# EasyEDA Pro project ProPrj_ch32_dev.epro

# Schematic Schematic1
Board Name: Board1; Create Date: 2026-04-19; Page Name: P1; Project Name: ch32_dev; Schematic Name: Schematic1; Update Date: 2026-04-19; Company: EasyEDA.com; Page Size: A4; Version: V1.0
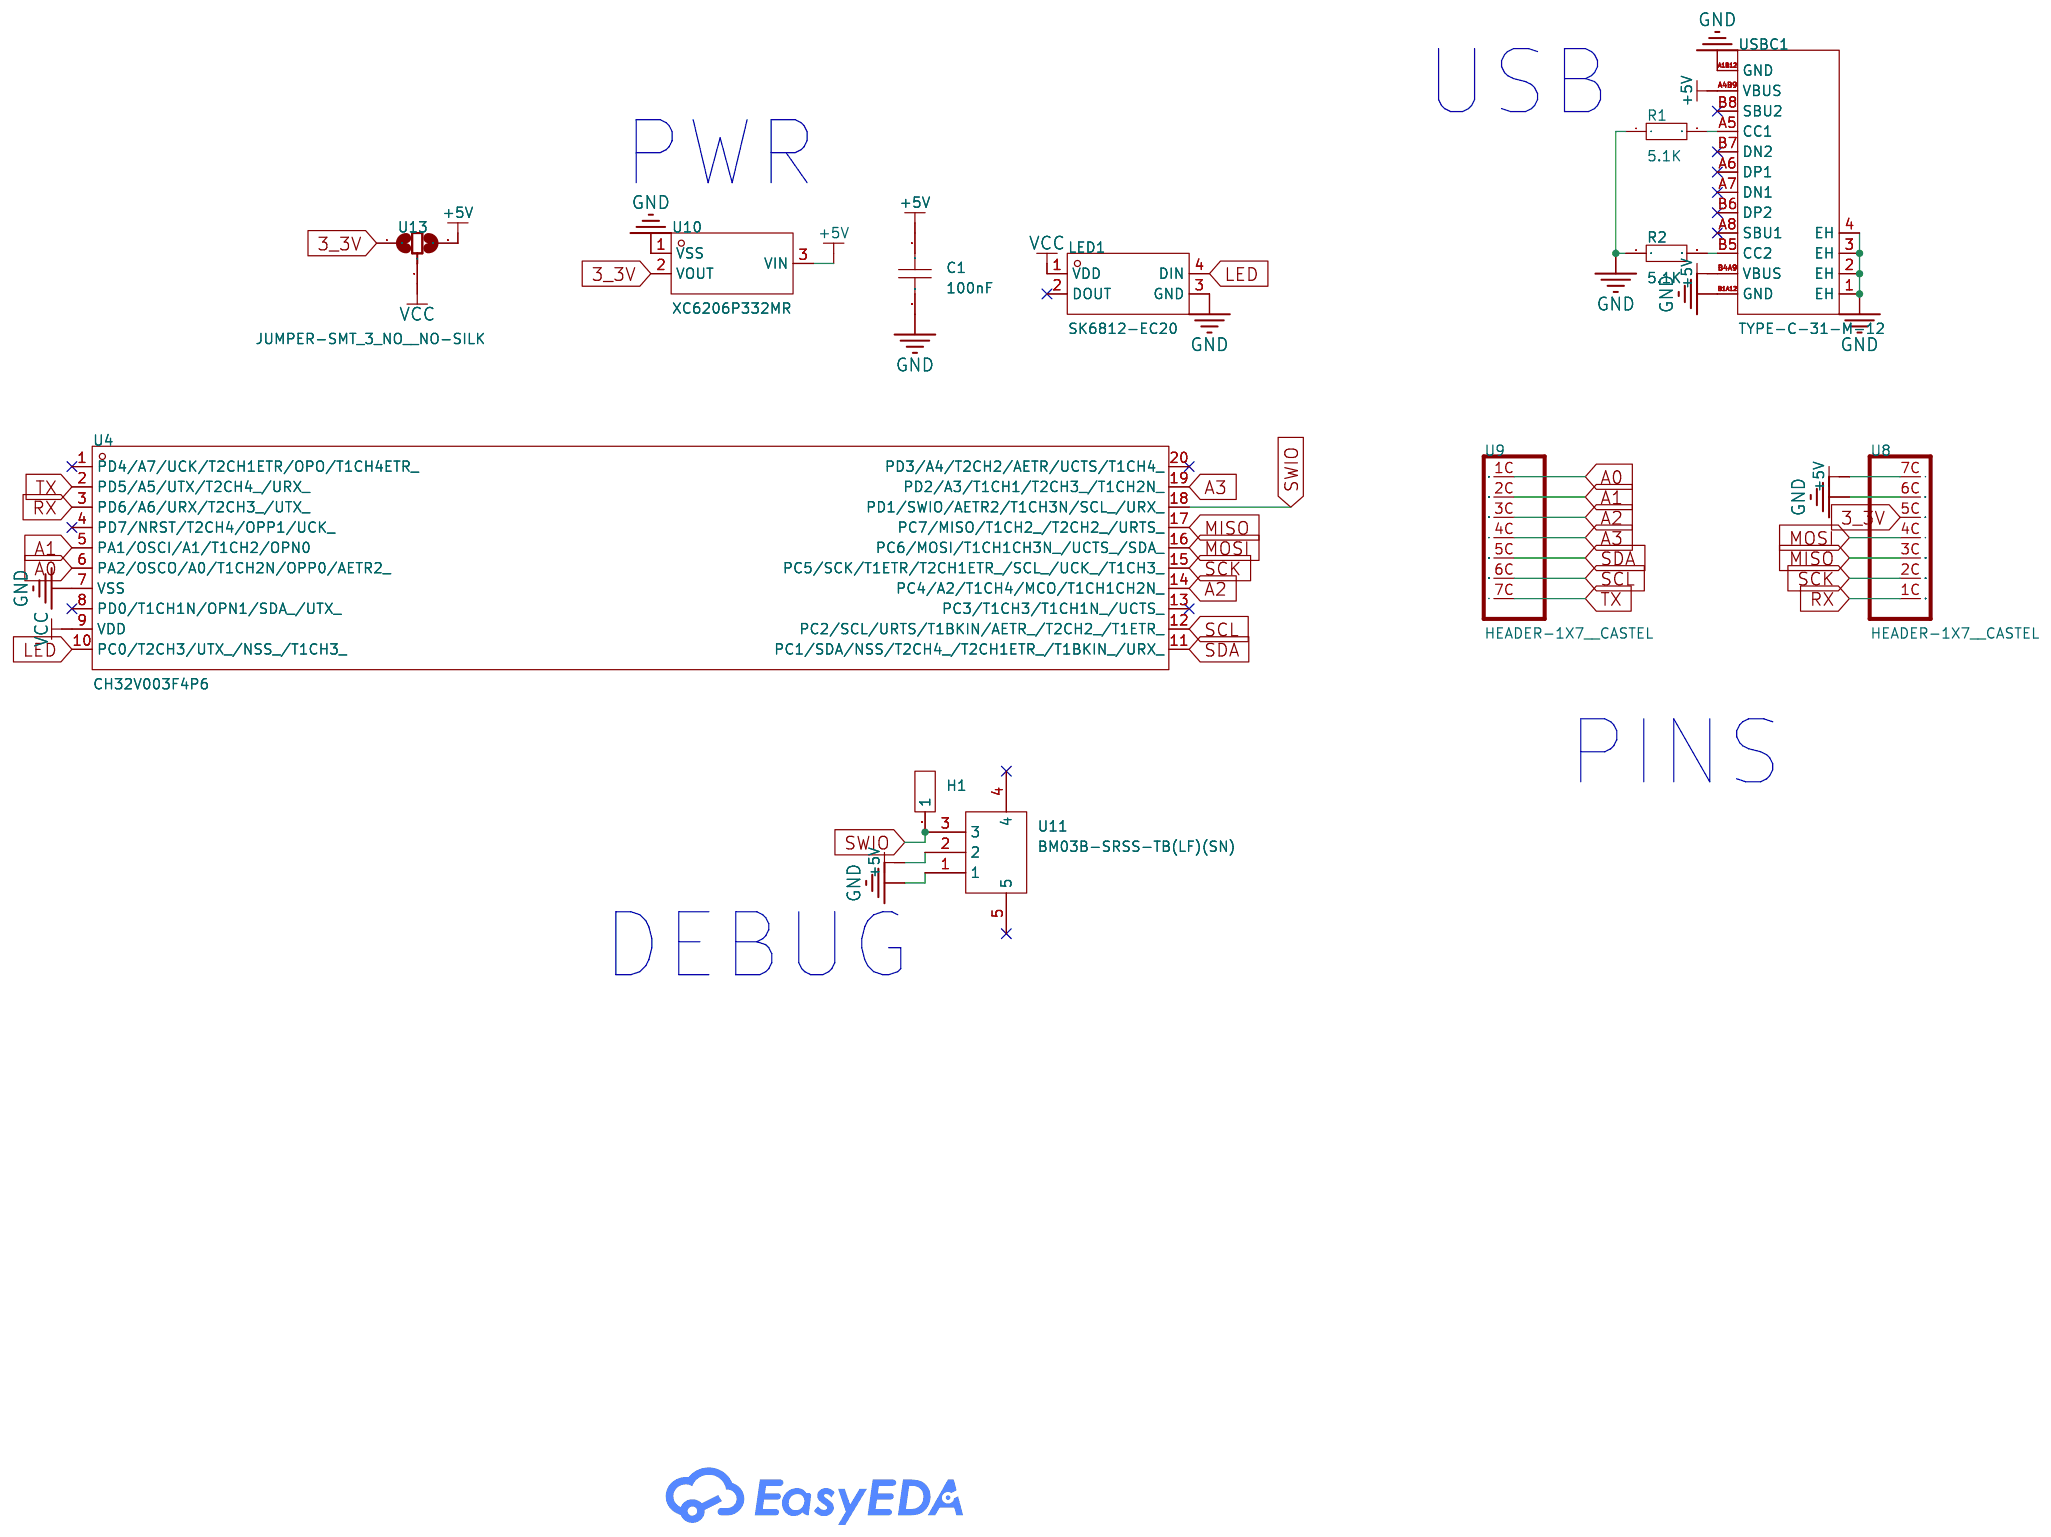
[diagram p0: schematic sheet]

## Parts
C1  100nF  [C0603]
H1  -  [HDR-TH_1P-V-M_XKB_X4611WV-01I-C28D40]
LED1  SK6812-EC20  [LED-SMD_4P-L2.0-W2.0-BR]
R1  5.1K  [R0603]
R2  5.1K  [R0603]
U4  CH32V003F4P6  [TSSOP-20_L6.5-W4.4-P0.65-LS6.4-BL]
U8  HEADER-1X7__CASTEL  [1X07_CASTEL]
U9  HEADER-1X7__CASTEL  [1X07_CASTEL]
U10  XC6206P332MR  [SOT-23-3_L3.0-W1.7-P0.95-LS2.9-BR]
U11  BM03B-SRSS-TB(LF)(SN)  [CONN-SMD-3P-P1.00_BM03B-SRSS-TB-LF-SN]
U13  JUMPER-SMT_3_NO__NO-SILK  [SMT-JUMPER_3_NO_NO-SILK]
USBC1  TYPE-C-31-M-12  [USB-C_SMD-TYPE-C-31-M-12_1]

## Library data of the parts
C1 = CAP_0603: Supplier Footprint: 0603
H1 = HDR-M_2.54_1x1P: Supplier Footprint: Through
LED1 = SK6812-EC20: Wavelength:620nm~630nm；520nm~535nm；460nm~475nm Operating Temperature:-40℃~+80℃; LCSC Part Name: RGB三色; Supplier Part: C2909058; Manufacturer: 欧思科光电; Supplier Footprint: SMD,2x2mm; JLCPCB Part Class: Extended Part; Datasheet: https://item.szlcsc.com/datasheet/SK6812-EC20/3185286.html; Supplier: LCSC; Wavelength: 620nm~630nm；520nm~535nm；460nm~475nm; Operating Temperature: -40℃~+80℃
R1 R2 = Res_0603: Supplier Footprint: 0603
U4 = CH32V003F4P6: LCSC Part Name: QingKe V2微处理器; Supplier Part: C5187096; Manufacturer: WCH(南京沁恒); Supplier Footprint: TSSOP-20-175mil; JLCPCB Part Class: Extended Part; Datasheet: https://item.szlcsc.com/datasheet/CH32V003F4P6/5858783.html; Supplier: LCSC
U8 U9 = HEADER-1X7__CASTEL
U10 = XC6206P332MR_C347376: Output Type:Fixed Voltage - Supply:8V Output Voltage:3.3V Output Voltage:3.3V Output Current:250mA Power Supply Rejection Ratio (PSRR):40dB@(1kHz) Voltage Dropout:240mV@(50mA) standby current:7uA Noise:- Features:Over Current Protection；Short Circuit Prot; LCSC Part Name: 高纹波抑制率、低功耗、低压差 CMOS 降压型电压稳压器; Supplier Part: C347376; Manufacturer: UMW(友台半导体); Supplier Footprint: SOT-23; JLCPCB Part Class: Extended Part; Datasheet: https://item.szlcsc.com/datasheet/XC6206P332MR/324036.html; Supplier: LCSC; Output Type: Fixed; Voltage - Supply: 8V; Output Voltage: 3.3V; Output Current: 250mA; Power Supply Rejection Ratio (PSRR): 40dB@(1kHz); Voltage Dropout: 240mV@(50mA); standby current: 7uA; Features: Over Current Protection；Short Circuit Protection; Operating Temperature: -25℃~+80℃@(Ta); Output Configuration: Positive; Number of Outputs: 1
U11 = BM03B-SRSS-TB(LF)(SN): Pins Structure:1x3P Pitch:1mm Mounting Type:Surface Mount,Vertical Reference Series:SH Number of Pins:3P Number of Rows:1 Number of PINs Per Row:3 Row Spacing:- Current Rating:1A Contact Material:Copper Alloy Contact Plating:Tin Operating Temperature:-25℃; LCSC Part Name: 1x3P 间距:1mm 立贴 系列:SH; Supplier Part: C160389; Manufacturer: JST; Supplier Footprint: SMD,P=1mm; JLCPCB Part Class: Extended Part; Datasheet: https://item.szlcsc.com/datasheet/BM03B-SRSS-TB(LF)(SN)/171769.html; Supplier: LCSC; Pins Structure: 1x3P; Pitch: 1mm; Mounting Type: Surface Mount,Vertical; Reference Series: SH; Number of Pins: 3P; Number of Rows: 1; Number of PINs Per Row: 3; Current Rating: 1A; Contact Material: Copper Alloy; Contact Plating: Tin; Operating Temperature: -25℃~+85℃; Voltage Rating: 50V; Plastic Material: PA; Flame Retardant Rating: UL94V-0; Supplementary Features: Auxiliary Solder Pin; Color: White; Z-Height of the Board: 4.25mm; X-Length of Bottom Edge on Board (Spacing Line): 5mm; Y-Width of Bottom Edge on Board: 3.6mm
U13 = JUMPER-SMT_3_NO__NO-SILK
USBC1 = TYPE-C-31-M-12: Connector Type:Type-C Protocol Standard:- Gender:Female Mounting Type:Surface Mount, Right Angle Number of Contacts:16P Number of Ports:1 Current Rating-Power:5A Voltage Rating:20V Connect-Disconnect Life:10,000 cycles Length:7.35mm Operating Temperature:; LCSC Part Name: Type-C 母 卧贴; Supplier Part: C165948; Manufacturer: 韩国韩荣; Supplier Footprint: SMD; JLCPCB Part Class: Extended Part; Datasheet: https://item.szlcsc.com/datasheet/TYPE-C-31-M-12/177331.html; Supplier: LCSC; Connector Type: Type-C; Gender: Female; Mounting Type: Surface Mount, Right Angle; Number of Contacts: 16P; Number of Ports: 1; Current Rating-Power: 5A; Voltage Rating: 20V; Connect-Disconnect Life: 10,000 cycles; Length: 7.35mm; Operating Temperature: -30℃~+80℃

## Nets
+5V: C1.1 U8.7C(7) U10.3(VIN) U11.2 U13.3 USBC1.A4B9(VBUS) USBC1.B4A9(VBUS)
GND: C1.2 LED1.3(GND) R1.1 R2.1 U4.7(VSS) U8.6C(6) U10.1(VSS) U11.1 USBC1.1(EH) USBC1.2(EH) USBC1.3(EH) USBC1.4(EH) USBC1.A1B12(GND) USBC1.B1A12(GND)
VCC: LED1.1(VDD) U4.9(VDD) U13.2
3_3V: U8.5C(5) U10.2(VOUT) U13.1
A0: U4.6(PA2/OSCO/A0/T1CH2N/OPP0/AETR2_) U9.1C
A1: U4.5(PA1/OSCI/A1/T1CH2/OPN0) U9.2C
A2: U4.14(PC4/A2/T1CH4/MCO/T1CH1CH2N_) U9.3C
A3: U4.19(PD2/A3/T1CH1/T2CH3_/T1CH2N_) U9.4C(4)
LED: LED1.4(DIN) U4.10(PC0/T2CH3/UTX_/NSS_/T1CH3_)
MISO: U4.17(PC7/MISO/T1CH2_/T2CH2_/URTS_) U8.3C
MOSI: U4.16(PC6/MOSI/T1CH1CH3N_/UCTS_/SDA_) U8.4C(4)
RX: U4.3(PD6/A6/URX/T2CH3_/UTX_) U8.1C
SCK: U4.15(PC5/SCK/T1ETR/T2CH1ETR_/SCL_/UCK_/T1CH3_) U8.2C
SCL: U4.12(PC2/SCL/URTS/T1BKIN/AETR_/T2CH2_/T1ETR_) U9.6C(6)
SDA: U4.11(PC1/SDA/NSS/T2CH4_/T2CH1ETR_/T1BKIN_/URX_) U9.5C(5)
SWIO: H1.1 U4.18(PD1/SWIO/AETR2/T1CH3N/SCL_/URX_) U11.3
TX: U4.2(PD5/A5/UTX/T2CH4_/URX_) U9.7C(7)
$1N1231: R2.2 USBC1.B5(CC2)
$1N1237: R1.2 USBC1.A5(CC1)

Not connected (* = marked no-connect by the designer): LED1 2(DOUT)*; U4 1(PD4/A7/UCK/T2CH1ETR/OPO/T1CH4ETR_)* 4(PD7/NRST/T2CH4/OPP1/UCK_)* 8(PD0/T1CH1N/OPN1/SDA_/UTX_)* 13(PC3/T1CH3/T1CH1N_/UCTS_)* 20(PD3/A4/T2CH2/AETR/UCTS/T1CH4_)*; U11 4* 5*; USBC1 A6(DP1)* A7(DN1)* A8(SBU1)* B6(DP2)* B7(DN2)* B8(SBU2)*

## Notes on the sheet
- USB
- PWR
- PINS
- DEBUG

# Schematic Schematic1_1
Board Name: Board1_manual_route; Create Date: 2026-04-25; Page Name: P1; Project Name: ch32_dev; Schematic Name: Schematic1_1; Update Date: 2026-04-25; Company: EasyEDA.com; Page Size: A4; Version: V1.0
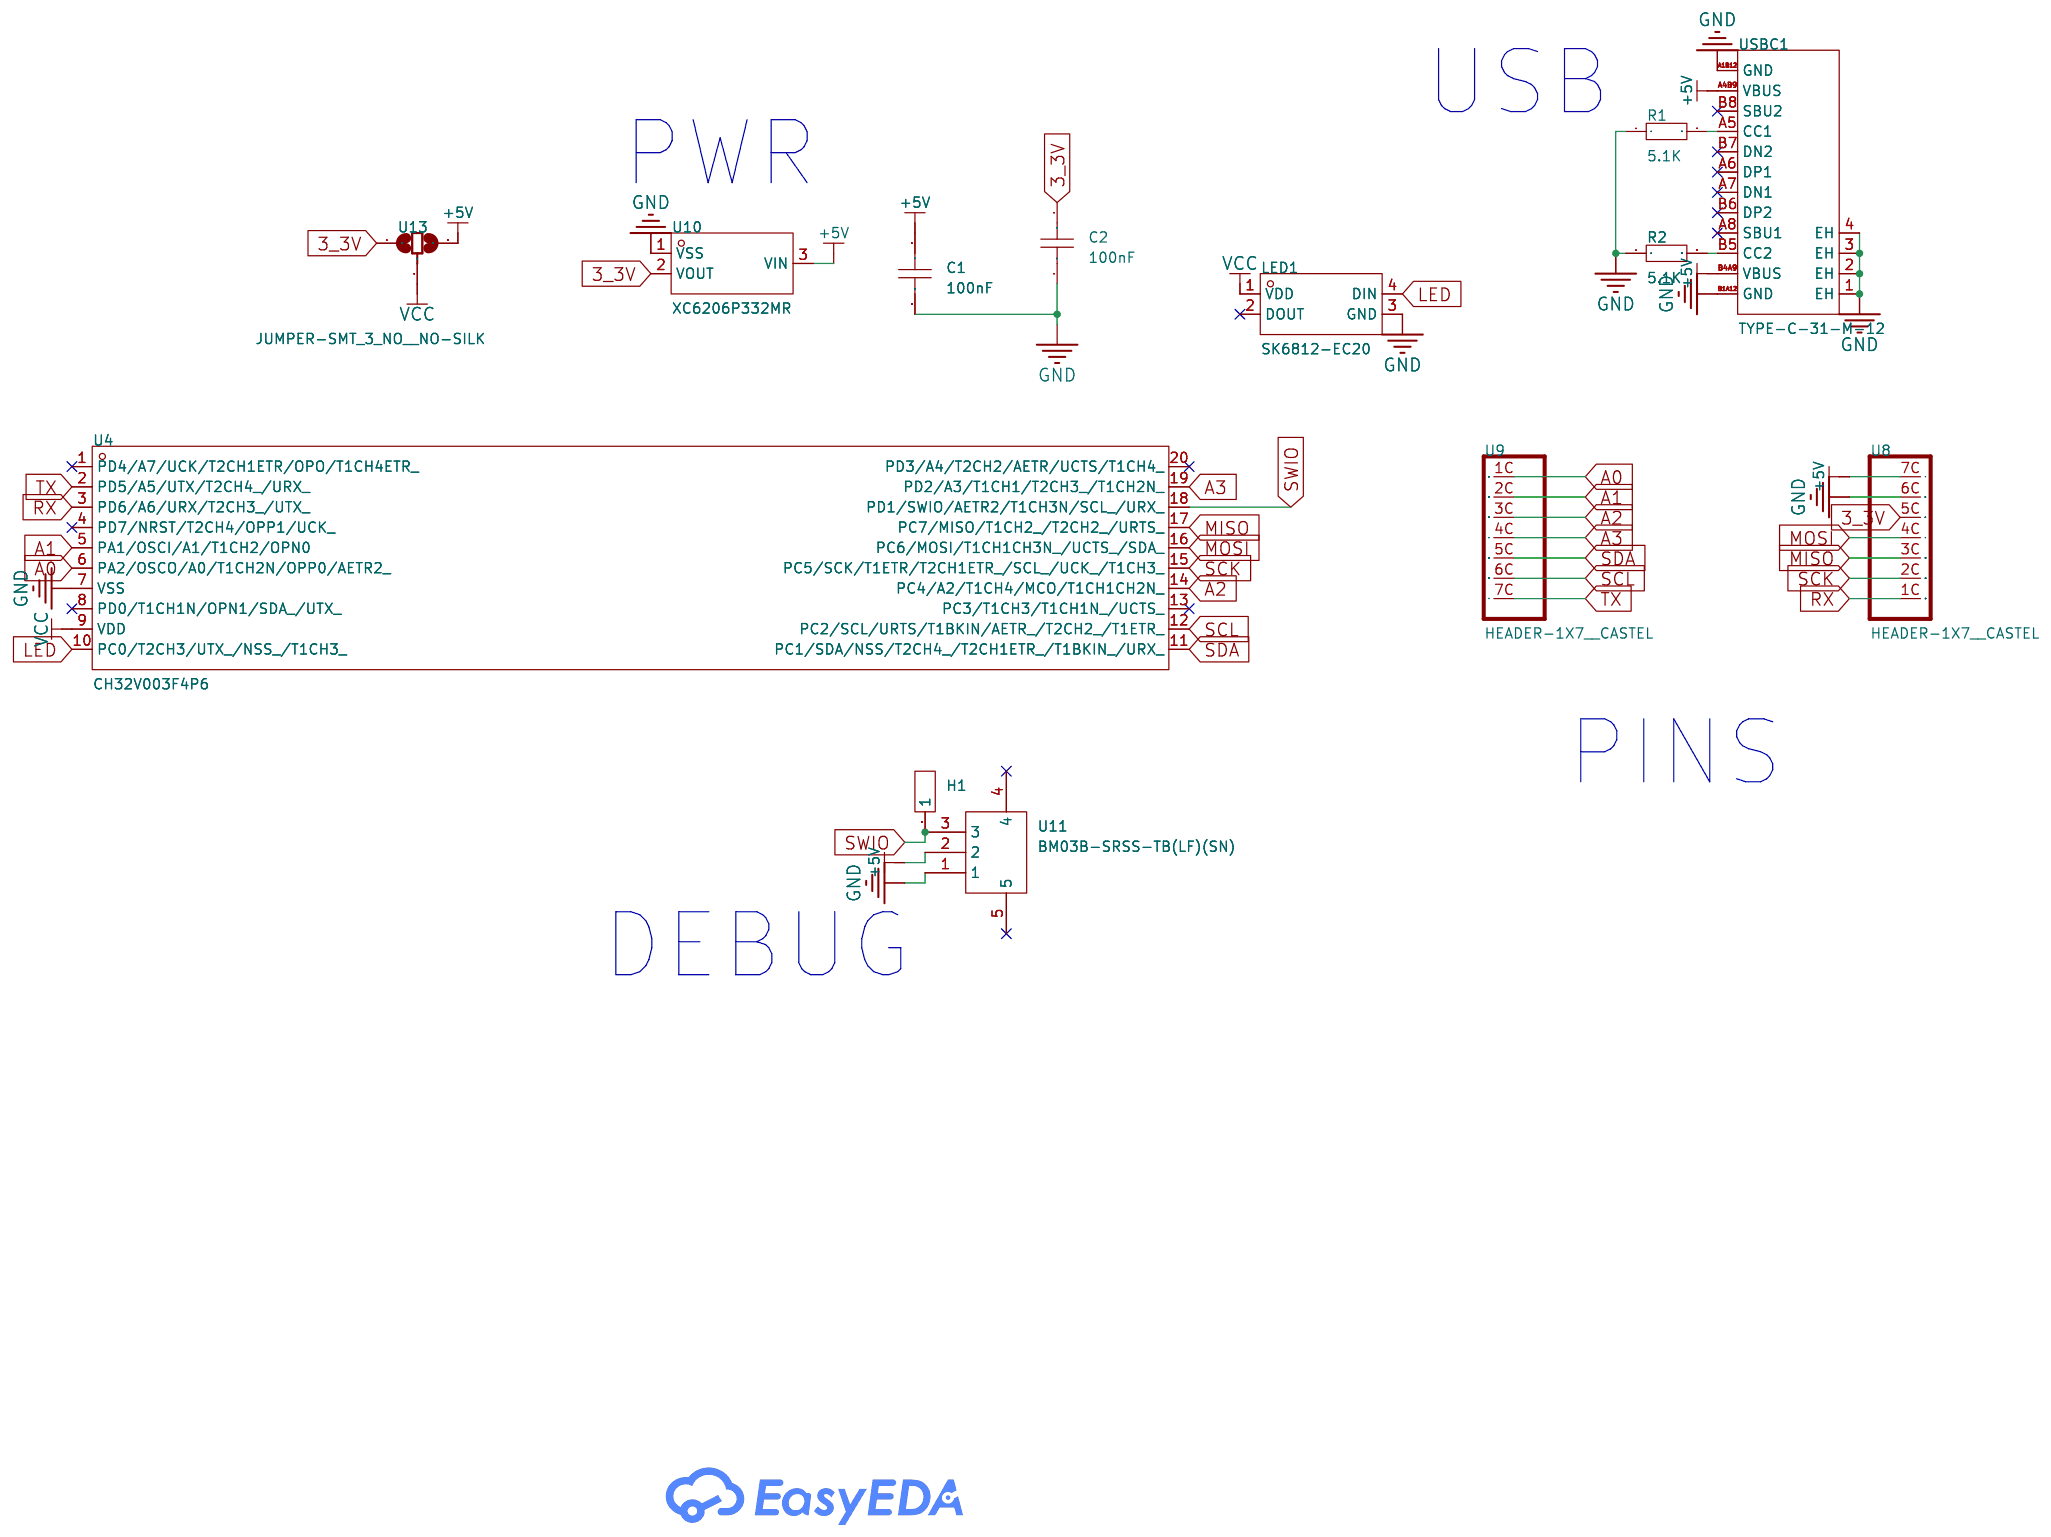
[diagram p1: schematic sheet]

## Parts
C1  100nF  [C0603]
C2  100nF  [C0603]
H1  -  [HDR-TH_1P-V-M_XKB_X4611WV-01I-C28D40]
LED1  SK6812-EC20  [LED-SMD_4P-L2.0-W2.0-BR]
R1  5.1K  [R0603]
R2  5.1K  [R0603]
U4  CH32V003F4P6  [TSSOP-20_L6.5-W4.4-P0.65-LS6.4-BL]
U8  HEADER-1X7__CASTEL  [1X07_CASTEL]
U9  HEADER-1X7__CASTEL  [1X07_CASTEL]
U10  XC6206P332MR  [SOT-23-3_L3.0-W1.7-P0.95-LS2.9-BR]
U11  BM03B-SRSS-TB(LF)(SN)  [CONN-SMD-3P-P1.00_BM03B-SRSS-TB-LF-SN]
U13  JUMPER-SMT_3_NO__NO-SILK  [SMT-JUMPER_3_NO_NO-SILK]
USBC1  TYPE-C-31-M-12  [USB-C_SMD-TYPE-C-31-M-12_1]

## Library data of the parts
C1 C2 = CAP_0603: Supplier Footprint: 0603
H1 = HDR-M_2.54_1x1P: Supplier Footprint: Through
LED1 = SK6812-EC20: Wavelength:620nm~630nm；520nm~535nm；460nm~475nm Operating Temperature:-40℃~+80℃; LCSC Part Name: RGB三色; Supplier Part: C2909058; Manufacturer: 欧思科光电; Supplier Footprint: SMD,2x2mm; JLCPCB Part Class: Extended Part; Datasheet: https://item.szlcsc.com/datasheet/SK6812-EC20/3185286.html; Supplier: LCSC; Wavelength: 620nm~630nm；520nm~535nm；460nm~475nm; Operating Temperature: -40℃~+80℃
R1 R2 = Res_0603: Supplier Footprint: 0603
U4 = CH32V003F4P6: LCSC Part Name: QingKe V2微处理器; Supplier Part: C5187096; Manufacturer: WCH(南京沁恒); Supplier Footprint: TSSOP-20-175mil; JLCPCB Part Class: Extended Part; Datasheet: https://item.szlcsc.com/datasheet/CH32V003F4P6/5858783.html; Supplier: LCSC
U8 U9 = HEADER-1X7__CASTEL
U10 = XC6206P332MR_C347376: Output Type:Fixed Voltage - Supply:8V Output Voltage:3.3V Output Voltage:3.3V Output Current:250mA Power Supply Rejection Ratio (PSRR):40dB@(1kHz) Voltage Dropout:240mV@(50mA) standby current:7uA Noise:- Features:Over Current Protection；Short Circuit Prot; LCSC Part Name: 高纹波抑制率、低功耗、低压差 CMOS 降压型电压稳压器; Supplier Part: C347376; Manufacturer: UMW(友台半导体); Supplier Footprint: SOT-23; JLCPCB Part Class: Extended Part; Datasheet: https://item.szlcsc.com/datasheet/XC6206P332MR/324036.html; Supplier: LCSC; Output Type: Fixed; Voltage - Supply: 8V; Output Voltage: 3.3V; Output Current: 250mA; Power Supply Rejection Ratio (PSRR): 40dB@(1kHz); Voltage Dropout: 240mV@(50mA); standby current: 7uA; Features: Over Current Protection；Short Circuit Protection; Operating Temperature: -25℃~+80℃@(Ta); Output Configuration: Positive; Number of Outputs: 1
U11 = BM03B-SRSS-TB(LF)(SN): Pins Structure:1x3P Pitch:1mm Mounting Type:Surface Mount,Vertical Reference Series:SH Number of Pins:3P Number of Rows:1 Number of PINs Per Row:3 Row Spacing:- Current Rating:1A Contact Material:Copper Alloy Contact Plating:Tin Operating Temperature:-25℃; LCSC Part Name: 1x3P 间距:1mm 立贴 系列:SH; Supplier Part: C160389; Manufacturer: JST; Supplier Footprint: SMD,P=1mm; JLCPCB Part Class: Extended Part; Datasheet: https://item.szlcsc.com/datasheet/BM03B-SRSS-TB(LF)(SN)/171769.html; Supplier: LCSC; Pins Structure: 1x3P; Pitch: 1mm; Mounting Type: Surface Mount,Vertical; Reference Series: SH; Number of Pins: 3P; Number of Rows: 1; Number of PINs Per Row: 3; Current Rating: 1A; Contact Material: Copper Alloy; Contact Plating: Tin; Operating Temperature: -25℃~+85℃; Voltage Rating: 50V; Plastic Material: PA; Flame Retardant Rating: UL94V-0; Supplementary Features: Auxiliary Solder Pin; Color: White; Z-Height of the Board: 4.25mm; X-Length of Bottom Edge on Board (Spacing Line): 5mm; Y-Width of Bottom Edge on Board: 3.6mm
U13 = JUMPER-SMT_3_NO__NO-SILK
USBC1 = TYPE-C-31-M-12: Connector Type:Type-C Protocol Standard:- Gender:Female Mounting Type:Surface Mount, Right Angle Number of Contacts:16P Number of Ports:1 Current Rating-Power:5A Voltage Rating:20V Connect-Disconnect Life:10,000 cycles Length:7.35mm Operating Temperature:; LCSC Part Name: Type-C 母 卧贴; Supplier Part: C165948; Manufacturer: 韩国韩荣; Supplier Footprint: SMD; JLCPCB Part Class: Extended Part; Datasheet: https://item.szlcsc.com/datasheet/TYPE-C-31-M-12/177331.html; Supplier: LCSC; Connector Type: Type-C; Gender: Female; Mounting Type: Surface Mount, Right Angle; Number of Contacts: 16P; Number of Ports: 1; Current Rating-Power: 5A; Voltage Rating: 20V; Connect-Disconnect Life: 10,000 cycles; Length: 7.35mm; Operating Temperature: -30℃~+80℃

## Nets
+5V: C1.1 U8.7C(7) U10.3(VIN) U11.2 U13.3 USBC1.A4B9(VBUS) USBC1.B4A9(VBUS)
GND: C1.2 C2.2 LED1.3(GND) R1.1 R2.1 U4.7(VSS) U8.6C(6) U10.1(VSS) U11.1 USBC1.1(EH) USBC1.2(EH) USBC1.3(EH) USBC1.4(EH) USBC1.A1B12(GND) USBC1.B1A12(GND)
VCC: LED1.1(VDD) U4.9(VDD) U13.2
3_3V: C2.1 U8.5C(5) U10.2(VOUT) U13.1
A0: U4.6(PA2/OSCO/A0/T1CH2N/OPP0/AETR2_) U9.1C
A1: U4.5(PA1/OSCI/A1/T1CH2/OPN0) U9.2C
A2: U4.14(PC4/A2/T1CH4/MCO/T1CH1CH2N_) U9.3C
A3: U4.19(PD2/A3/T1CH1/T2CH3_/T1CH2N_) U9.4C(4)
LED: LED1.4(DIN) U4.10(PC0/T2CH3/UTX_/NSS_/T1CH3_)
MISO: U4.17(PC7/MISO/T1CH2_/T2CH2_/URTS_) U8.3C
MOSI: U4.16(PC6/MOSI/T1CH1CH3N_/UCTS_/SDA_) U8.4C(4)
RX: U4.3(PD6/A6/URX/T2CH3_/UTX_) U8.1C
SCK: U4.15(PC5/SCK/T1ETR/T2CH1ETR_/SCL_/UCK_/T1CH3_) U8.2C
SCL: U4.12(PC2/SCL/URTS/T1BKIN/AETR_/T2CH2_/T1ETR_) U9.6C(6)
SDA: U4.11(PC1/SDA/NSS/T2CH4_/T2CH1ETR_/T1BKIN_/URX_) U9.5C(5)
SWIO: H1.1 U4.18(PD1/SWIO/AETR2/T1CH3N/SCL_/URX_) U11.3
TX: U4.2(PD5/A5/UTX/T2CH4_/URX_) U9.7C(7)
$1N1231: R2.2 USBC1.B5(CC2)
$1N1237: R1.2 USBC1.A5(CC1)

Not connected (* = marked no-connect by the designer): LED1 2(DOUT)*; U4 1(PD4/A7/UCK/T2CH1ETR/OPO/T1CH4ETR_)* 4(PD7/NRST/T2CH4/OPP1/UCK_)* 8(PD0/T1CH1N/OPN1/SDA_/UTX_)* 13(PC3/T1CH3/T1CH1N_/UCTS_)* 20(PD3/A4/T2CH2/AETR/UCTS/T1CH4_)*; U11 4* 5*; USBC1 A6(DP1)* A7(DN1)* A8(SBU1)* B6(DP2)* B7(DN2)* B8(SBU2)*

## Notes on the sheet
- USB
- PWR
- PINS
- DEBUG

# Board PCB1
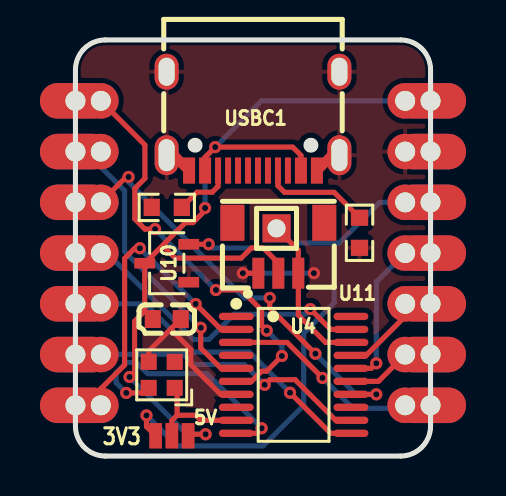
[diagram p2: board, top side]
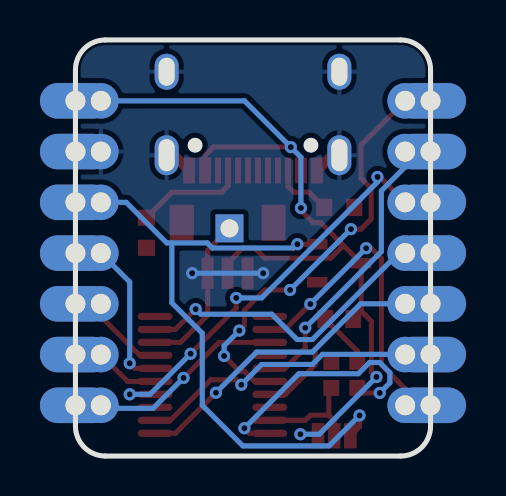
[diagram p3: board, bottom side, seen from below]

Outline 17.78 x 20.83 mm; copper layers: Top Layer, Bottom Layer. Coordinates in mm from the lower left corner of the outline.
Outline path: 0,19.33 0,1.5 arc(0.44,0.44) 1.5,0 16.28,0 arc(17.34,0.44) 17.78,1.5 17.78,19.33 arc(17.34,20.39) 16.28,20.83 1.5,20.83 arc(0.44,20.39) 0,19.33
Stack: Top Layer 0.035mm / Dielectric1 1.51mm FR4 er 4.5 / Bottom Layer 0.035mm

## Design rules (mm)
template: Custom Config
spacing copperThickness1oz (default): track to track 0.102, other pairs 0.152 to 0.3
spacing copperThickness2oz: track to track 0.203, other pairs 0.152 to 0.3
track width copperThickness1oz (default): min 0.127, default 0.254, max 2.54
track width copperThickness2oz: min 0.203, default 0.254, max 2.54
differential pair differentialPair (default): width min 0.127, default 0.254, max 2.54; gap min 0.152, default 0.152
via viaSize (default): diameter min 0.5, default 0.61, max 10; hole min 0.3, default 0.305, max 6.3

## Placement (name value [footprint] x y rotation side)
5V  JUMPER-SMT_3_NO__NO-SILK  [SMT-JUMPER_3_NO_NO-SILK]  4.83 1.02 0 top
C1  100nF  [C0603]  4.57 6.86 0 top
H1  -  [HDR-TH_1P-V-M_XKB_X4611WV-01I-C28D40]  10.07 11.4 0 top
LED1  SK6812-EC20  [LED-SMD_4P-L2.0-W2.0-BR]  4.32 4.06 0 top
R1  5.1K  [R0603]  14.22 11.18 90 top
R2  5.1K  [R0603]  4.57 12.45 0 top
U4  CH32V003F4P6  [TSSOP-20_L6.5-W4.4-P0.65-LS6.4-BL]  10.92 4.06 270 top
U8  HEADER-1X7__CASTEL  [1X07_CASTEL]  16.51 10.16 90 top
U9  HEADER-1X7__CASTEL  [1X07_CASTEL]  1.27 10.16 270 top
U10  XC6206P332MR  [SOT-23-3_L3.0-W1.7-P0.95-LS2.9-BR]  4.57 9.65 0 top
U11  BM03B-SRSS-TB(LF)(SN)  [CONN-SMD-3P-P1.00_BM03B-SRSS-TB-LF-SN]  10.16 10.41 180 top
USBC1  TYPE-C-31-M-12  [USB-C_SMD-TYPE-C-31-M-12_1]  8.89 16.76 180 top

## Footprints (pads in the part's own frame, mm; a bottom-side part is the same pattern mirrored in y, then rotated)
1X07_CASTEL
  round 1.778 hole 1: 1C(-7.62,0) 2C(-5.08,0) 3C(-2.54,0) 4C(0,0) 5C(2.54,0) 6C(5.08,0) 7C(7.62,0)
  oval 1.778x3.556 hole 1: 1C(-7.62,-1.27) 2C(-5.08,-1.27) 3C(-2.54,-1.27) 4C(0,-1.27) 5C(2.54,-1.27) 6C(5.08,-1.27) 7C(7.62,-1.27)
C0603
  rect 0.8x0.9 smd: 1(-0.7,0) 2(0.7,0)
CONN-SMD-3P-P1.00_BM03B-SRSS-TB-LF-SN
  rect 0.6x1.55 smd: 1(1,1.262) 2(0,1.262) 3(-1,1.262)
  rect 1.2x1.8 smd: 4(2.3,-1.262) 5(-2.3,-1.262)
HDR-TH_1P-V-M_XKB_X4611WV-01I-C28D40
  rect 1.4x1.4 hole 0.9: 1(0,0)
LED-SMD_4P-L2.0-W2.0-BR
  rect 0.8x0.8 smd: 1(0.65,-0.65) 2(0.65,0.65) 3(-0.65,0.65) 4(-0.65,-0.65)
R0603
  rect 0.806x0.864 smd: 1(-0.753,0) 2(0.753,0)
SMT-JUMPER_3_NO_NO-SILK
  rect 0.635x1.27 smd: 1(-0.813,0) 2(0,0) 3(0.813,0)
SOT-23-3_L3.0-W1.7-P0.95-LS2.9-BR
  rect 1.038x0.532 smd: 1(1.101,-0.95) 2(1.101,0.95) 3(-1.101,0)
TSSOP-20_L6.5-W4.4-P0.65-LS6.4-BL
  oval 0.364x1.742 smd: 1(-2.925,-2.871) 2(-2.275,-2.871) 3(-1.625,-2.871) 4(-0.975,-2.871) 5(-0.325,-2.871) 6(0.325,-2.871) 7(0.975,-2.871) 8(1.625,-2.871) 9(2.275,-2.871) 10(2.925,-2.871) 11(2.925,2.871) 12(2.275,2.871) 13(1.625,2.871) 14(0.975,2.871) 15(0.325,2.871) 16(-0.325,2.871) 17(-0.975,2.871) 18(-1.625,2.871) 19(-2.275,2.871) 20(-2.925,2.871)
USB-C_SMD-TYPE-C-31-M-12_1
  oval 1.2x2 hole 0.8x1.6: 1(4.325,1.706) 4(-4.325,1.706)
  oval 1.2x1.8 hole 0.8x1.4: 2(4.325,-2.474) 3(-4.325,-2.474)
  custom 0.6x1.3 smd: A1B12(-3.2,2.474) A4B9(-2.4,2.474) B1A12(3.2,2.474) B4A9(2.401,2.474)
  rect 0.3x1.3 smd: A5(-1.25,2.474) A6(-0.25,2.474) A7(0.25,2.474) A8(1.25,2.474) B5(1.75,2.474) B6(0.75,2.474) B7(-0.75,2.474) B8(-1.75,2.474)

## Nets
As in the schematic, except:
+5V: 5V.3 C1.1 U8.7C U10.3 U11.2 USBC1.A4B9 USBC1.B4A9
VCC: 5V.2 LED1.1 U4.9
3_3V: 5V.1 U8.5C U10.2

Pads without a net: LED1 2; U4 1 4 8 13 20; U11 4 5; USBC1 A6 A7 A8 B6 B7 B8

## Via types
v1: diameter 0.61, hole 0.305, Top Layer to Bottom Layer, 26 vias

## Routing (per net, layer and track width the routed paths; a pad name or vN(x,y) marks a point on that pad's centre or on a via; arc(x,y) is an arc through that point)
+5V: length 44.2
  Top Layer w0.254: 4.49,10.67 U10.3 3.47,7.26 ; 4.49,10.67 5.5,11.68 5.88,11.68 6.49,12.29 v1(6.49,12.42) ; 4.49,10.67 4.49,10.41 4.99,9.91 8.3,9.91 8.8,10.41 9.41,10.41 10.17,9.65 10.17,9.16 U11.2 ; USBC1.A4B9 11.29,15.05 10.88,15.47 v1(7,15.47) 6.49,14.96 USBC1.B4A9 ; C1.1 3.47,7.26 ; 3.47,7.26 2.96,6.75 2.96,4.21 v1(2.71,3.96) ; 5.64,1.02 5.72,1.09 v1(6.52,1.09)
  Bottom Layer w0.254: v1(2.71,3.96) 5.57,1.09 v1(6.52,1.09) ; v1(6.49,12.42) 6.49,14.96 v1(7,15.47) 9.31,17.78 U8.7C
GND: length 15.1
  Top Layer w0.254: C1.2 4.76,6.35 ; 4.76,6.35 5.78,5.33 5.78,4.57 7.26,3.09 U4.7 ; 4.76,6.35 3.67,5.25 LED1.3 ; v1(8.38,9.15) U11.1
  Top Layer w0.508: USBC1.1 4.92,15.06 USBC1.B1A12 ; USBC1.A1B12 12.85,15.05 13.21,15.05 13.22,15.06
  Bottom Layer w0.254: v1(11.94,9.15) v1(8.38,9.15)
VCC: length 5.6
  Top Layer w0.254: 8.05,1.79 6.27,1.79 6.02,2.04 5.09,2.04 ; 5.09,2.04 5.09,3.29 LED1.1 ; 5.09,2.04 4.83,1.78 5V.2
3_3V: length 31.2
  Top Layer w0.254: v1(6.67,10.6) U10.2 ; 5V.1 3.56,1.47 v1(3.56,2.03)
  Bottom Layer w0.254: 12.95,10.67 12.95,7.67 11.43,6.15 11.43,2.54 9.4,0.51 5.08,0.51 v1(3.56,2.03) ; 12.95,10.67 13.21,10.67 15.24,12.7 U8.5C ; 12.95,10.67 11.18,10.67 10.92,10.41 6.86,10.41 v1(6.67,10.6)
A0: length 20.8
  Top Layer w0.254: U9.1C 3.48,15.57 3.48,13.9 2.97,13.39 2.97,11.87 3.48,11.36 v1(3.99,11.36) ; v1(10.34,5.01) 9.57,4.25 9.32,4.25 8.81,3.74 U4.6 ; v1(9.57,6.28) 9.32,6.53 9.32,7.3 8.31,8.31 v1(7.03,8.31)
  Bottom Layer w0.254: v1(10.34,5.01) 10.34,5.52 v1(9.57,6.28) ; v1(7.03,8.31) v1(3.99,11.36)
A1: length 14.1
  Top Layer w0.254: U4.5 7.29,4.39 6.27,5.41 v1(6.27,6.42)
  Bottom Layer w0.254: U9.2C 1.27,14.47 2.46,13.28 2.46,10.23 v1(6.27,6.42)
A2: length 20.5
  Top Layer w0.254: v1(9.73,7.92) 9.73,7.41 v1(12.01,5.12) ; U9.3C 2.54,13.97 v1(2.66,13.97) ; U4.14 v1(15.06,3.09)
  Bottom Layer w0.254: v1(12.01,5.12) 14.05,3.09 v1(15.06,3.09) ; v1(2.66,13.97) 2.66,13.72 8.46,7.92 v1(9.73,7.92)
A3: length 15.4
  Top Layer w0.254: U4.19 12.78,6.34 v1(11.76,7.36)
  Bottom Layer w0.254: U9.4C 1.59,10.16 5.92,5.83 6.68,5.83 7.95,7.1 11.51,7.1 v1(11.76,7.36)
LED: length 12.7
  Top Layer w0.254: U4.10 9.07,1.14 v1(9.32,1.39) ; LED1.4 3.41,3.16 v1(2.54,3.16)
  Bottom Layer w0.254: v1(9.32,1.39) 6.59,4.12 3.61,4.12 3.05,4.68 2.54,4.68 2.04,4.18 2.04,3.67 v1(2.54,3.16)
MISO: length 4.2
  Top Layer w0.254: U4.17 14.56,5.04 16.51,6.99 U8.3C
MOSI: length 7.5
  Top Layer w0.254: v1(15.06,4.64) 14.81,4.39 U4.16
  Bottom Layer w0.254: v1(15.06,4.64) 15.06,8.71 U8.4C
RX: length 9.9
  Top Layer w0.254: v1(12.37,3.91) 10.59,5.69 U4.3
  Bottom Layer w0.254: v1(12.37,3.91) 13.89,2.39 16.36,2.39 U8.1C
SCK: length 3.3
  Top Layer w0.254: U4.15 15.17,3.74 U8.2C
SCL: length 14.1
  Top Layer w0.254: 13.79,1.79 13.03,1.79 11,3.82 9.73,3.82 v1(9.47,3.57)
  Bottom Layer w0.254: v1(9.47,3.57) 8.46,4.58 5.92,4.58 5.41,5.09 1.35,5.09 U9.6C
SDA: length 15.2
  Top Layer w0.254: U4.11 12.78,1.14 v1(10.75,3.17)
  Bottom Layer w0.254: U9.5C 3.5,7.62 5.92,5.2 8.71,5.2 v1(10.75,3.17)
SWIO: length 8
  Top Layer w0.254: U4.18 12.52,5.69 11.16,7.05 U11.3 11.16,10.3 H1.1
TX: length 15.3
  Top Layer w0.254: v1(3.22,10.4) 2.97,10.4 2.46,9.89 2.46,4.56 1.27,3.37 U9.7C ; U4.2 7.29,6.34 v1(6.02,7.61)
  Bottom Layer w0.254: v1(6.02,7.61) v1(3.22,10.4)
$1N1231: length 3
  Top Layer w0.254: USBC1.B5 7.14,13.5 6.85,13.21 6.09,13.21 R2.2
$1N1237: length 5.5
  Top Layer w0.254: USBC1.A5 10.14,13.53 10.47,13.2 12.95,13.2 R1.2

## Copper pours and planes (outline as drawn; the poured copper is in the pictures)
GND on Top Layer: -3.05,22.86 22.61,22.86 22.61,-4.06 -3.05,-4.06
GND on Bottom Layer: -3.05,24.38 19.56,24.38 19.56,-1.02 -3.05,-1.02

## Text on the board
Top Silkscreen Layer: 3V3

# Board PCB1_1
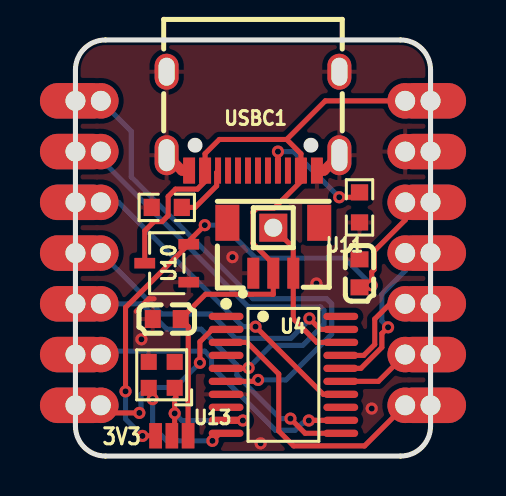
[diagram p4: board, top side]
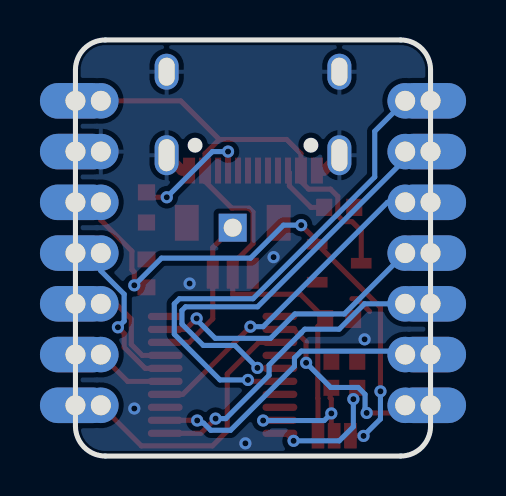
[diagram p5: board, bottom side, seen from below]

Outline 17.78 x 20.83 mm; copper layers: Top Layer, Bottom Layer. Coordinates in mm from the lower left corner of the outline.
Outline path: 0,19.33 0,1.5 arc(0.44,0.44) 1.5,0 16.28,0 arc(17.34,0.44) 17.78,1.5 17.78,19.33 arc(17.34,20.39) 16.28,20.83 1.5,20.83 arc(0.44,20.39) 0,19.33
Stack: Top Layer 0.035mm / Dielectric1 1.51mm FR4 er 4.5 / Bottom Layer 0.035mm

## Design rules (mm)
template: Custom Config
spacing copperThickness1oz (default): track to track 0.102, other pairs 0.152 to 0.3
spacing copperThickness2oz: track to track 0.203, other pairs 0.152 to 0.3
track width copperThickness1oz (default): min 0.127, default 0.254, max 2.54
track width copperThickness2oz: min 0.203, default 0.254, max 2.54
differential pair differentialPair (default): width min 0.127, default 0.254, max 2.54; gap min 0.152, default 0.152
via viaSize (default): diameter min 0.5, default 0.61, max 10; hole min 0.3, default 0.305, max 6.3

## Placement (name value [footprint] x y rotation side)
C1  100nF  [C0603]  4.57 6.86 180 top
C2  100nF  [C0603]  14.22 9.14 90 top
H1  -  [HDR-TH_1P-V-M_XKB_X4611WV-01I-C28D40]  9.91 11.43 0 top
LED1  SK6812-EC20  [LED-SMD_4P-L2.0-W2.0-BR]  4.32 4.06 0 top
R1  5.1K  [R0603]  14.22 12.45 90 top
R2  5.1K  [R0603]  4.57 12.45 0 top
U4  CH32V003F4P6  [TSSOP-20_L6.5-W4.4-P0.65-LS6.4-BL]  10.41 4.06 270 top
U8  HEADER-1X7__CASTEL  [1X07_CASTEL]  16.51 10.16 90 top
U9  HEADER-1X7__CASTEL  [1X07_CASTEL]  1.27 10.16 270 top
U10  XC6206P332MR  [SOT-23-3_L3.0-W1.7-P0.95-LS2.9-BR]  4.57 9.65 0 top
U11  BM03B-SRSS-TB(LF)(SN)  [CONN-SMD-3P-P1.00_BM03B-SRSS-TB-LF-SN]  9.91 10.41 180 top
U13  JUMPER-SMT_3_NO__NO-SILK  [SMT-JUMPER_3_NO_NO-SILK]  4.83 1.02 0 top
USBC1  TYPE-C-31-M-12  [USB-C_SMD-TYPE-C-31-M-12_1]  8.89 16.76 180 top

## Footprints (pads in the part's own frame, mm; a bottom-side part is the same pattern mirrored in y, then rotated)
1X07_CASTEL
  round 1.778 hole 1: 1C(-7.62,0) 2C(-5.08,0) 3C(-2.54,0) 4C(0,0) 5C(2.54,0) 6C(5.08,0) 7C(7.62,0)
  oval 1.778x3.556 hole 1: 1C(-7.62,-1.27) 2C(-5.08,-1.27) 3C(-2.54,-1.27) 4C(0,-1.27) 5C(2.54,-1.27) 6C(5.08,-1.27) 7C(7.62,-1.27)
C0603
  rect 0.8x0.9 smd: 1(-0.7,0) 2(0.7,0)
CONN-SMD-3P-P1.00_BM03B-SRSS-TB-LF-SN
  rect 0.6x1.55 smd: 1(1,1.262) 2(0,1.262) 3(-1,1.262)
  rect 1.2x1.8 smd: 4(2.3,-1.262) 5(-2.3,-1.262)
HDR-TH_1P-V-M_XKB_X4611WV-01I-C28D40
  rect 1.4x1.4 hole 0.9: 1(0,0)
LED-SMD_4P-L2.0-W2.0-BR
  rect 0.8x0.8 smd: 1(0.65,-0.65) 2(0.65,0.65) 3(-0.65,0.65) 4(-0.65,-0.65)
R0603
  rect 0.806x0.864 smd: 1(-0.753,0) 2(0.753,0)
SMT-JUMPER_3_NO_NO-SILK
  rect 0.635x1.27 smd: 1(-0.813,0) 2(0,0) 3(0.813,0)
SOT-23-3_L3.0-W1.7-P0.95-LS2.9-BR
  rect 1.038x0.532 smd: 1(1.101,-0.95) 2(1.101,0.95) 3(-1.101,0)
TSSOP-20_L6.5-W4.4-P0.65-LS6.4-BL
  oval 0.364x1.742 smd: 1(-2.925,-2.871) 2(-2.275,-2.871) 3(-1.625,-2.871) 4(-0.975,-2.871) 5(-0.325,-2.871) 6(0.325,-2.871) 7(0.975,-2.871) 8(1.625,-2.871) 9(2.275,-2.871) 10(2.925,-2.871) 11(2.925,2.871) 12(2.275,2.871) 13(1.625,2.871) 14(0.975,2.871) 15(0.325,2.871) 16(-0.325,2.871) 17(-0.975,2.871) 18(-1.625,2.871) 19(-2.275,2.871) 20(-2.925,2.871)
USB-C_SMD-TYPE-C-31-M-12_1
  oval 1.2x2 hole 0.8x1.6: 1(4.325,1.706) 4(-4.325,1.706)
  oval 1.2x1.8 hole 0.8x1.4: 2(4.325,-2.474) 3(-4.325,-2.474)
  custom 0.6x1.3 smd: A1B12(-3.2,2.474) A4B9(-2.4,2.474) B1A12(3.2,2.474) B4A9(2.401,2.474)
  rect 0.3x1.3 smd: A5(-1.25,2.474) A6(-0.25,2.474) A7(0.25,2.474) A8(1.25,2.474) B5(1.75,2.474) B6(0.75,2.474) B7(-0.75,2.474) B8(-1.75,2.474)

## Nets
As in the schematic.

Pads without a net: LED1 2; U4 1 4 8 13 20; U11 4 5; USBC1 A6 A7 A8 B6 B7 B8

## Via types
v1: diameter 0.61, hole 0.305, Top Layer to Bottom Layer, 24 vias

## Routing (per net, layer and track width the routed paths; a pad name or vN(x,y) marks a point on that pad's centre or on a via; arc(x,y) is an arc through that point)
+5V: length 39.8
  Top Layer w0.254: U8.7C 12.51,17.78 10.58,15.85 ; 10.58,15.85 11.29,15.13 USBC1.A4B9 11.29,13.75 9.95,12.41 9.09,12.41 8.89,12.21 8.89,10.64 9.91,9.62 U11.2 9.91,8.1 6.51,8.1 C1.1 5.65,6.48 5.65,2.9 5.64,2.89 5.64,1.02 ; 10.58,15.85 7.2,15.85 6.49,15.13 USBC1.B4A9 6.49,13.75 6.11,13.36 5.01,13.36 4.64,12.99 4.64,12.04 4.34,11.73 3.94,11.73 3.47,11.27 U10.3
GND: length 4
  Top Layer w0.254: 3.94,7.87 3.68,7.87 3.05,7.24
  Top Layer w0.508: 13.22,15.06 12.45,14.29 USBC1.A1B12 ; USBC1.B1A12 5.33,14.29 USBC1.1
  vias: v1(3.3,5.84) v1(7.86,9.96) v1(9.27,0.64) v1(12.06,8.64) v1(14.83,2.38)
VCC: length 6.9
  Top Layer w0.254: LED1.1 5.03,3.36 5.03,2.91 4.97,2.85 v1(4.97,2.13) 4.97,1.16 U13.2 ; v1(8.38,1.78) 8.37,1.79 7.54,1.79
  Bottom Layer w0.254: v1(8.38,1.78) 5.32,1.78 v1(4.97,2.13)
3_3V: length 28.3
  Top Layer w0.254: v1(2.51,3.24) 2.51,7.44 U10.2 5.67,10.75 v1(6.48,11.56) ; v1(3.36,1.01) 3.36,1.02 U13.1 ; U8.5C 16.51,11.81 14.95,10.25 14.95,9.33 14.83,9.21 v1(14.83,8.55) 14.73,8.44 C2.1
  Bottom Layer w0.254: v1(6.48,11.56) 7.37,11.56 9.02,9.91 13.47,9.91 v1(14.83,8.55) ; v1(2.51,3.24) 2.51,1.86 v1(3.36,1.01)
A0: length 24.9
  Top Layer w0.254: v1(9.14,3.81) 9.07,3.74 7.54,3.74
  Bottom Layer w0.254: v1(9.14,3.81) 10.54,3.81 12.83,6.1 12.83,7.62 12.58,7.87 8.89,7.87 2.79,13.97 2.79,16.26 U9.1C
A1: length 21.2
  Top Layer w0.254: 7.54,4.39 8.65,4.39 v1(8.67,4.41)
  Bottom Layer w0.254: v1(8.67,4.41) 9.79,5.54 11.38,5.54 12.45,6.6 12.45,7.29 12.27,7.47 8.66,7.47 1.27,14.86 U9.2C
A2: length 16
  Top Layer w0.254: U4.14 12.41,3.09 v1(9.02,6.48)
  Bottom Layer w0.254: v1(9.02,6.48) 8.38,6.48 2.16,12.7 U9.3C
A3: length 14.5
  Top Layer w0.254: v1(11.71,6.89) 12.26,6.34 U4.19
  Bottom Layer w0.254: U9.4C 4.32,7.11 6.79,7.11 8.01,5.89 10.78,5.89 11.71,6.82 v1(11.71,6.89)
LED: length 6.2
  Top Layer w0.254: LED1.4 3.86,3.22 v1(3.86,2.85) ; v1(6.86,0.76) 7.24,1.14 7.54,1.14
  Bottom Layer w0.254: v1(3.86,2.85) 3.86,1.47 4.57,0.76 v1(6.86,0.76)
MISO: length 5
  Top Layer w0.254: U8.3C 15.75,7.62 14.99,6.86 14.99,5.59 14.44,5.04 U4.17
MOSI: length 8
  Top Layer w0.254: U4.16 14.29,4.39 15.34,5.44 15.34,6.13 v1(15.65,6.44)
  Bottom Layer w0.254: U8.4C 16.51,9.27 15.34,8.1 15.34,6.76 v1(15.65,6.44)
RX: length 13.6
  Top Layer w0.254: 7.54,5.69 8.6,5.69 10.18,4.11 10.18,1.25 10.92,0.51 14.48,0.51 U8.1C
SCK: length 3.8
  Top Layer w0.254: U4.15 15.17,3.74 U8.2C
SCL: length 14.2
  Top Layer w0.254: 13.28,1.79 11.99,1.79 11.98,1.78 v1(11.69,1.78)
  Bottom Layer w0.254: U9.6C 1.44,5.25 6.47,5.25 6.81,4.91 6.81,4.49 10.01,1.29 11.01,1.29 11.37,1.65 11.56,1.65 v1(11.69,1.78)
SDA: length 15
  Top Layer w0.254: U4.11 11.5,1.14 v1(10.76,1.87)
  Bottom Layer w0.254: U9.5C 3.31,7.62 4.58,6.35 6.3,6.35 6.48,6.17 6.48,6.16 8.08,4.55 8.08,4.04 10.25,1.87 v1(10.76,1.87)
SWIO: length 7.8
  Top Layer w0.254: H1.1 10.91,10.43 U11.3 10.91,6.87 12.09,5.69 U4.18
TX: length 9.3
  Top Layer w0.254: v1(6.23,4.67) 6.23,5.72 6.85,6.34 7.54,6.34 ; 3.18,2.16 1.65,2.16 U9.7C
  Bottom Layer w0.254: v1(6.23,4.67) 5,3.43 3.62,3.43 3.28,3.09 3.28,2.37 3.2,2.29 v1(3.2,2.16)
$1N1231: length 3
  Top Layer w0.254: USBC1.B5 7.14,14.26 7.07,14.19 7.07,13.52 5.99,12.45 R2.2
$1N1237: length 6.1
  Top Layer w0.254: R1.2 13.98,12.95 v1(13.21,12.95) ; USBC1.A5 v1(10.14,15.24)
  Bottom Layer w0.254: v1(10.14,15.24) 10.92,15.24 v1(13.21,12.95)

## Copper pours and planes (outline as drawn; the poured copper is in the pictures)
GND on Top Layer: -2.79,23.11 22.86,23.11 22.86,-3.81 -2.79,-3.81
GND on Bottom Layer: -2.29,23.88 20.32,23.88 20.32,-1.52 -2.29,-1.52

## Text on the board
Top Silkscreen Layer: 3V3
